# EAGLE schematic ardustatversion7 (EAGLE 5.10)
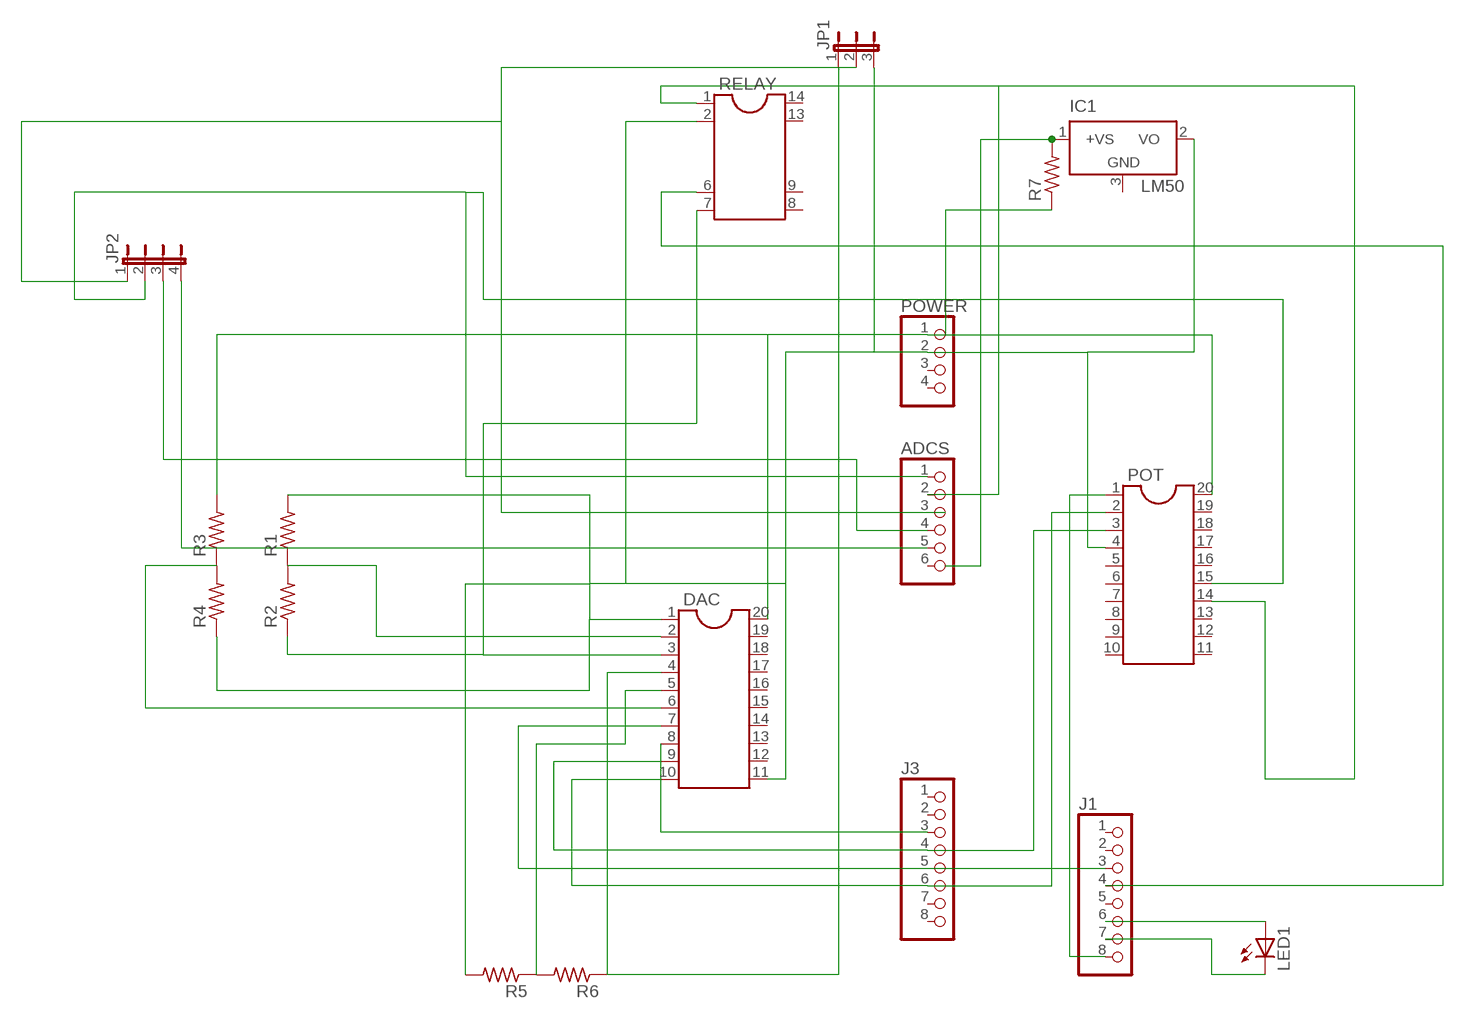
[diagram p0: schematic, sheet 1]

## Parts
ADCS  PINHD-1X6  [1X06]
DAC  DIL20S  [SOCKED-20]
IC1  LM50  [SOT23]
J1  PINHD-1X8  [1X08]
J3  PINHD-1X8  [1X08]
JP1  JP2E  [JP2]
JP2  JP4E  [JP4]
LED1  LED5MM  [LED5MM]
POT  DIL20S  [SOCKED-20]
POWER  PINHD-1X4  [1X04]
R1  R-US_0207/12  [0207/12]
R2  R-US_0207/12  [0207/12]
R3  R-US_0207/12  [0207/12]
R4  R-US_0207/12  [0207/12]
R5  R-US_0207/12  [0207/12]
R6  R-US_0207/12  [0207/12]
R7  R-US_0207/12  [0207/12]
RELAY  DIL14/8  [DIL14/8]

## Nets
N$1: DAC.6 R3.1 R4.2
N$2: DAC.10 J3.6 POT.2
N$3: DAC.9 J3.4 POT.3
N$4: DAC.8 J3.3
N$5: DAC.7 J1.3
N$6: J1.4 RELAY.6
N$7: DAC.2 R1.1 R2.2
N$8: ADCS.1 JP2.2 POT.15
N$9: J1.8 POT.1
N$10: DAC.20 POT.20 POWER.1 R3.2 R7.1
N$11: ADCS.2 POT.14 RELAY.1
N$12: DAC.5 R5.1 R6.2
N$15: DAC.3 R2.1 RELAY.7
N$16: DAC.4 JP1.1 R6.1
N$17: J1.6 LED1.A
N$18: J1.7 LED1.K(C)
N$19: IC1.1(+VS) R7.2
N$21: JP1.2 JP2.1
N$24: ADCS.5 JP2.4
N$27: DAC.1 DAC.11 IC1.2(VO) JP1.3 POT.4 POWER.2 R1.2 R4.1 R5.2 RELAY.2
N$28: ADCS.4 JP2.3
Unconnected: ADCS.3 ADCS.6 DAC.12 DAC.13 DAC.14 DAC.15 DAC.16 DAC.17 DAC.18 DAC.19 J1.1 J1.2 J1.5 J3.1 J3.2 J3.5 J3.7 J3.8 POT.5 POT.6 POT.7 POT.8 POT.9 POT.10 POT.11 POT.12 POT.13 POT.16 POT.17 POT.18 POT.19 POWER.3 POWER.4 RELAY.8 RELAY.9 RELAY.13 RELAY.14

## Power pins joined to a net without a drawn wire
GND: IC1.3(GND)

## Library data of the parts
ADCS = pinhead:PINHD-1X6: PIN HEADER
DAC POT = ic-package:DIL20: Dual In Line
IC1 = linear:LM50: SOT-23 Single-Supply Centigrade Temperature Sensor Vout = (10mV/°C x Temp °C) +5mmmV Source: http://cache.national.com/ds/LM/LM50.pdf
J1 J3 = pinhead:PINHD-1X8: PIN HEADER
JP1 = jumper:JP2E: JUMPER
JP2 = jumper:JP4E: JUMPER
LED1 = led:LED: LED OSRAM: - CHIPLED LG R971, LG N971, LY N971, LG Q971, LY Q971, LO R971, LY R971 LH N974, LH R974 LS Q976, LO Q976, LY Q976 LO Q996 - Hyper CHIPLED LW Q18S LB Q993, LB Q99A, LB R99A - SideLED LS A670, LO A670, LY A670, LG A670, LP A670 LB A673, LV A673, LT A673, LW A673 LH A674 LY A675 LS A676, LA A676, LO A676, LY A676, LW A676 LS A679, LY A679, LG A679 - Hyper Micro SIDELED® LS Y876, LA Y876, LO Y876, LY Y876 LT Y87S - SmartLED LW L88C, LW L88S LB L89C, LB L89S, LG L890 LS L89K, LO L89K, LY L89K LS L896, LA L896, LO L896, LY L896 - TOPLED LS T670, LO T670, LY T670, LG T670, LP T670 LSG T670, LSP T670, LSY T670, LOP T670, LYG T670 LG T671, LOG T671, LSG T671 LB T673, LV T673, LT T673, LW T673 LH T674 LS T676, LA T676, LO T676, LY T676, LB T676, LH T676, LSB T676, LW T676 LB T67C, LV T67C, LT T67C, LS T67K, LO T67K, LY T67K, LW E67C LS E67B, LA E67B, LO E67B, LY E67B, LB E67C, LV E67C, LT E67C LW T67C LS T679, LY T679, LG T679 LS T770, LO T770, LY T770, LG T770, LP T770 LB T773, LV T773, LT T773, LW T773 LH T774 LS E675, LA E675, LY E675, LS T675 LS T776, LA T776, LO T776, LY T776, LB T776 LHGB T686 LT T68C, LB T68C - Hyper Mini TOPLED® LB M676 - Mini TOPLED Santana® LG M470 LS M47K, LO M47K, LY M47K Source: http://www.osram.convergy.de - LUMILED® LXK2-PW12-R00, LXK2-PW12-S00, LXK2-PW14-U00, LXK2-PW14-V00 LXK2-PM12-R00, LXK2-PM12-S00, LXK2-PM14-U00 LXK2-PE12-Q00, LXK2-PE12-R00, LXK2-PE12-S00, LXK2-PE14-T00, LXK2-PE14-U00 LXK2-PB12-K00, LXK2-PB12-L00, LXK2-PB12-M00, LXK2-PB14-N00, LXK2-PB14-P00, LXK2-PB14-Q00 LXK2-PR12-L00, LXK2-PR12-M00, LXK2-PR14-Q00, LXK2-PR14-R00 LXK2-PD12-Q00, LXK2-PD12-R00, LXK2-PD12-S00 LXK2-PH12-R00, LXK2-PH12-S00 LXK2-PL12-P00, LXK2-PL12-Q00, LXK2-PL12-R00 Source: www.luxeon.com
POWER = pinhead:PINHD-1X4: PIN HEADER
R1-R7 = rcl:R-US_: RESISTOR, American symbol
RELAY = ic-package:DIL14/8: Dual In Line